# EAGLE design EasterEgg (EAGLE 8.6.0)
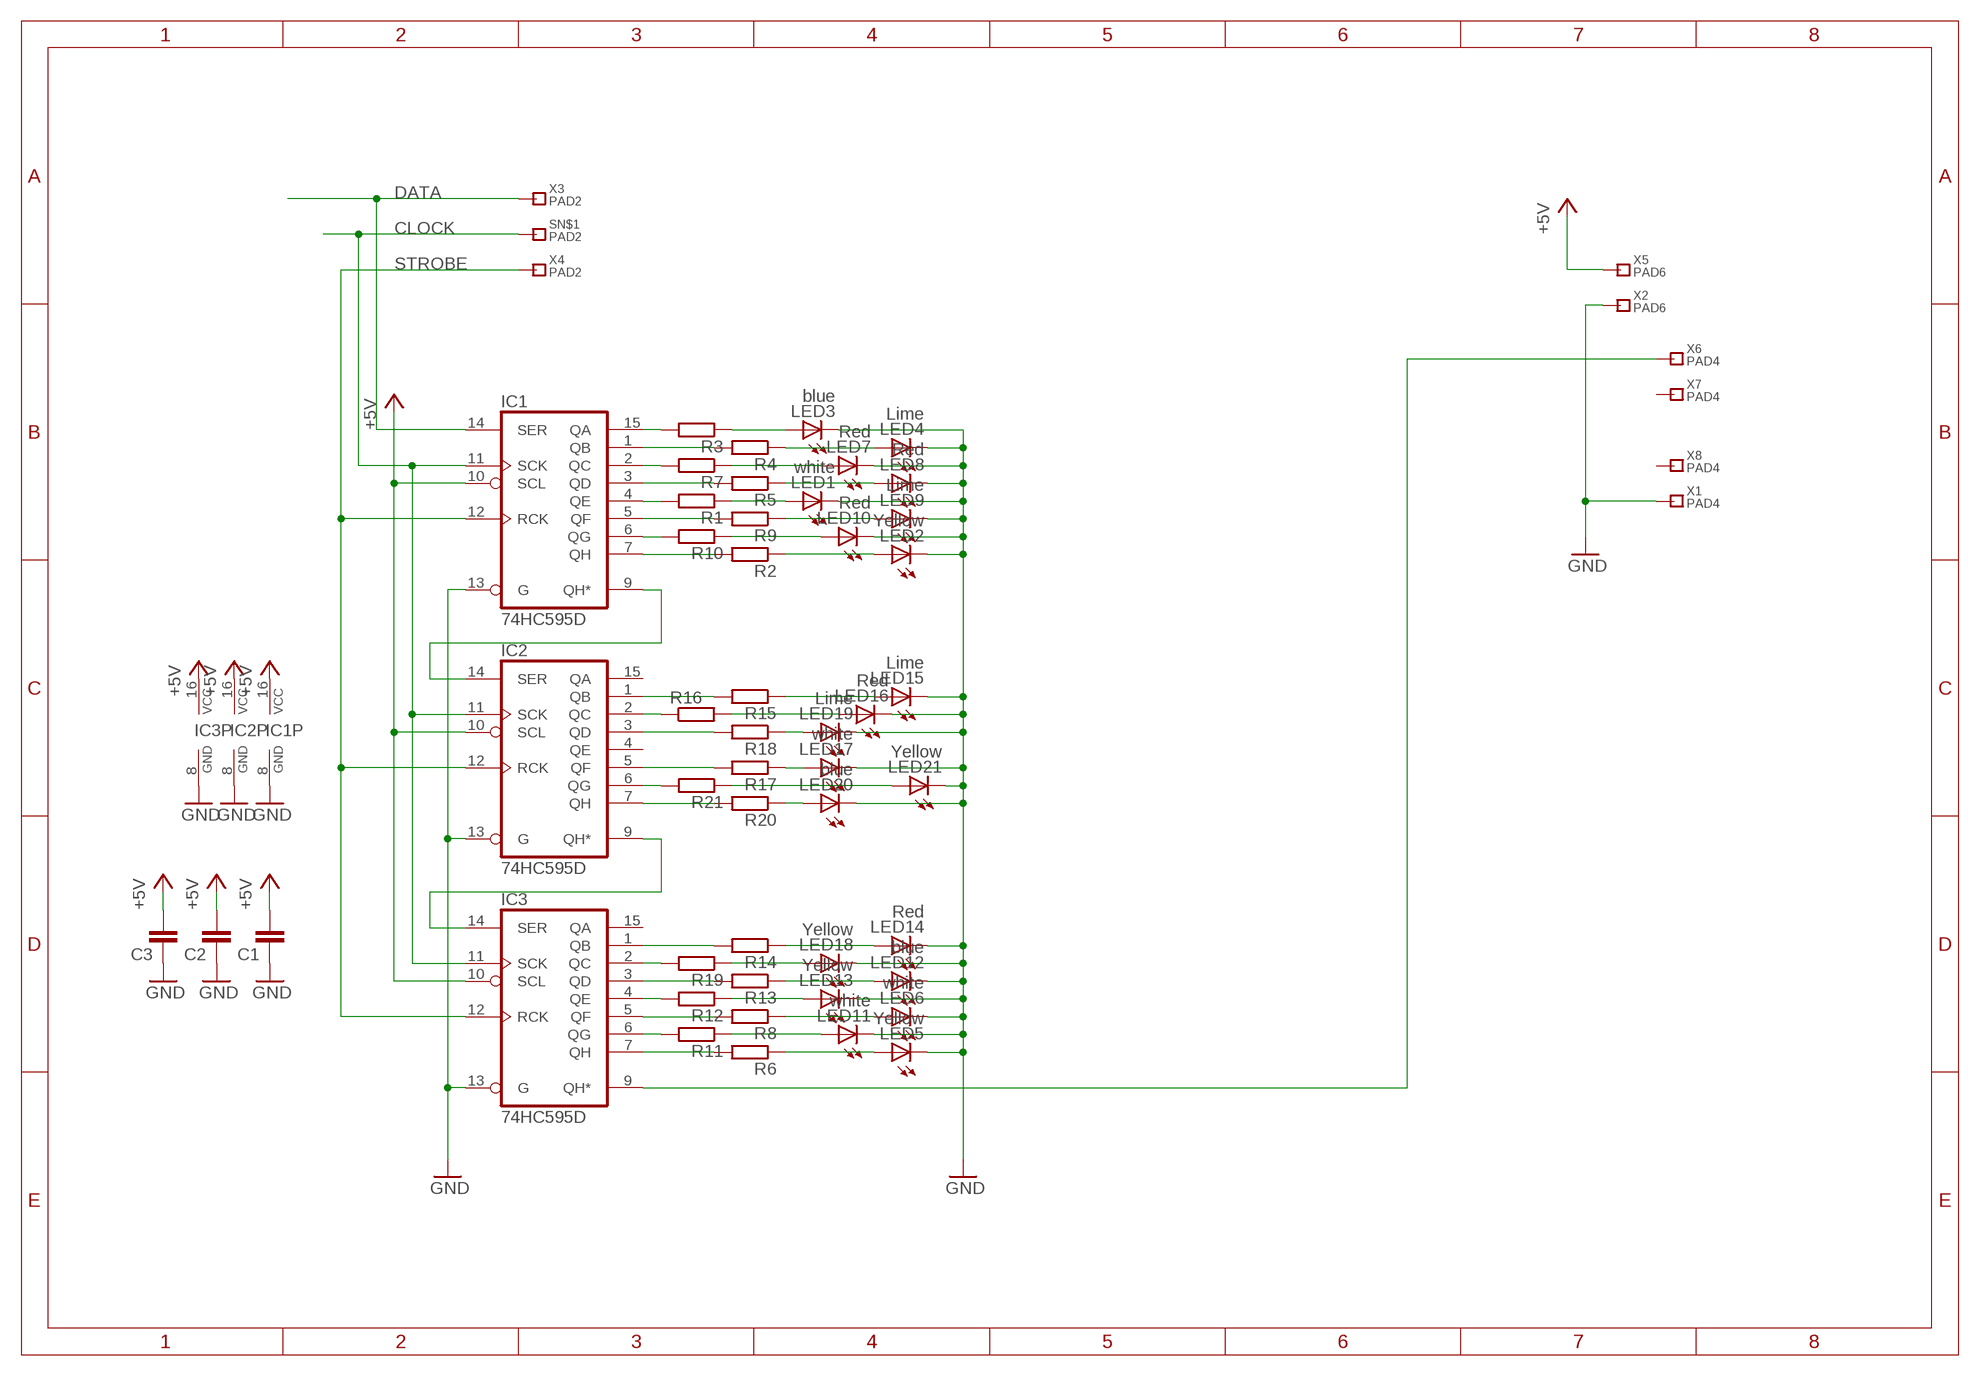
[diagram p0: schematic, sheet 1]

## Parts
C1  C-EUC0805  [C0805]
C2  C-EUC0805  [C0805]
C3  C-EUC0805  [C0805]
IC1  74HC595D  [SO16]
IC2  74HC595D  [SO16]
IC3  74HC595D  [SO16]
LED1  white  LED3MM  [LED3MM]
LED2  Yellow  LED3MM  [LED3MM]
LED3  blue  LED3MM  [LED3MM]
LED4  Lime  LED3MM  [LED3MM]
LED5  Yellow  LED3MM  [LED3MM]
LED6  white  LED3MM  [LED3MM]
LED7  Red  LED3MM  [LED3MM]
LED8  Red  LED3MM  [LED3MM]
LED9  Lime  LED3MM  [LED3MM]
LED10  Red  LED3MM  [LED3MM]
LED11  white  LED3MM  [LED3MM]
LED12  blue  LED3MM  [LED3MM]
LED13  Yellow  LED3MM  [LED3MM]
LED14  Red  LED3MM  [LED3MM]
LED15  Lime  LED3MM  [LED3MM]
LED16  Red  LED3MM  [LED3MM]
LED17  white  LED3MM  [LED3MM]
LED18  Yellow  LED3MM  [LED3MM]
LED19  Lime  LED3MM  [LED3MM]
LED20  blue  LED3MM  [LED3MM]
LED21  Yellow  LED3MM  [LED3MM]
R1  R-EU_R1206  [R1206]
R2  R-EU_R1206  [R1206]
R3  R-EU_R1206  [R1206]
R4  R-EU_R1206  [R1206]
R5  R-EU_R1206  [R1206]
R6  R-EU_R1206  [R1206]
R7  R-EU_R1206  [R1206]
R8  R-EU_R1206  [R1206]
R9  R-EU_R1206  [R1206]
R10  R-EU_R1206  [R1206]
R11  R-EU_R1206  [R1206]
R12  R-EU_R1206  [R1206]
R13  R-EU_R1206  [R1206]
R14  R-EU_R1206  [R1206]
R15  R-EU_R1206  [R1206]
R16  R-EU_R1206  [R1206]
R17  R-EU_R1206  [R1206]
R18  R-EU_R1206  [R1206]
R19  R-EU_R1206  [R1206]
R20  R-EU_R1206  [R1206]
R21  R-EU_R1206  [R1206]
SN$1  PAD2  [SMDPAD_S]
X1  PAD4  [SMDPAD_M]
X2  PAD6  [SMDPAD]
X3  PAD2  [SMDPAD_S]
X4  PAD2  [SMDPAD_S]
X5  PAD6  [SMDPAD]
X6  PAD4  [SMDPAD_M]
X7  PAD4  [SMDPAD_M]
X8  PAD4  [SMDPAD_M]

## Nets
+5V: C1.2 C2.2 C3.2 IC1.10(SCL) IC1.16(VCC) IC2.10(SCL) IC2.16(VCC) IC3.10(SCL) IC3.16(VCC) X5.P$1
CLOCK: IC1.11(SCK) IC2.11(SCK) IC3.11(SCK) SN$1.P$1
DATA: IC1.14(SER) X3.P$1
GND: C1.1 C2.1 C3.1 IC1.8(GND) IC1.13(G) IC2.8(GND) IC2.13(G) IC3.8(GND) IC3.13(G) LED1.K(C) LED2.K(C) LED3.K(C) LED4.K(C) LED5.K(C) LED6.K(C) LED7.K(C) LED8.K(C) LED9.K(C) LED10.K(C) LED11.K(C) LED12.K(C) LED13.K(C) LED14.K(C) LED15.K(C) LED16.K(C) LED17.K(C) LED18.K(C) LED19.K(C) LED20.K(C) LED21.K(C) X1.P$1 X2.P$1
N$2: IC1.2(QC) R7.2
N$3: IC1.9(QH*) IC2.14(SER)
N$4: IC2.9(QH*) IC3.14(SER)
N$5: LED7.A R7.1
N$6: IC1.1(QB) R4.2
N$7: LED4.A R4.1
N$8: IC1.15(QA) R3.2
N$9: LED3.A R3.1
N$10: IC1.7(QH) R2.2
N$11: LED2.A R2.1
N$12: IC1.3(QD) R5.2
N$13: IC1.4(QE) R1.2
N$14: IC1.5(QF) R9.2
N$15: IC1.6(QG) R10.2
N$16: IC2.1(QB) R15.2
N$17: IC2.2(QC) R16.1
N$18: IC2.3(QD) R18.2
N$19: IC2.7(QH) R20.2
N$20: IC2.5(QF) R17.2
N$21: IC2.6(QG) R21.2
N$22: IC3.2(QC) R19.2
N$23: IC3.1(QB) R14.2
N$24: IC3.5(QF) R8.2
N$25: IC3.4(QE) R12.2
N$26: IC3.3(QD) R13.2
N$27: IC3.6(QG) R11.2
N$28: IC3.7(QH) R6.2
N$29: LED10.A R10.1
N$30: LED16.A R16.2
N$31: LED19.A R18.1
N$32: LED20.A R20.1
N$33: LED21.A R21.1
N$34: LED18.A R19.1
N$35: LED14.A R14.1
N$36: LED12.A R13.1
N$37: LED13.A R12.1
N$38: LED5.A R6.1
N$39: LED11.A R11.1
N$40: LED6.A R8.1
N$41: LED17.A R17.1
N$42: LED8.A R5.1
N$43: LED1.A R1.1
N$44: LED9.A R9.1
N$45: LED15.A R15.1
N$46: IC3.9(QH*) X6.P$1
STROBE: IC1.12(RCK) IC2.12(RCK) IC3.12(RCK) X4.P$1
Unconnected: IC2.4(QE) IC2.15(QA) IC3.15(QA) X7.P$1 X8.P$1

## Library data of the parts
C1-C3 = rcl:C-EU: CAPACITOR, European symbol; SPICEPREFIX: C
IC1-IC3 = 74xx-eu:74*595: 8-bit SHIFT REGISTER, output latch
LED1-LED21 = led:LED: LED OSRAM: - CHIPLED LG R971, LG N971, LY N971, LG Q971, LY Q971, LO R971, LY R971 LH N974, LH R974 LS Q976, LO Q976, LY Q976 LO Q996 - Hyper CHIPLED LW Q18S LB Q993, LB Q99A, LB R99A - SideLED LS A670, LO A670, LY A670, LG A670, LP A670 LB A673, LV A673, LT A673, LW A673 LH A674 LY A675 LS A676, LA A676, LO A676, LY A676, LW A676 LS A679, LY A679, LG A679 - Hyper Micro SIDELED® LS Y876, LA Y876, LO Y876, LY Y876 LT Y87S - SmartLED LW L88C, LW L88S LB L89C, LB L89S, LG L890 LS L89K, LO L89K, LY L89K LS L896, LA L896, LO L896, LY L896 - TOPLED LS T670, LO T670, LY T670, LG T670, LP T670 LSG T670, LSP T670, LSY T670, LOP T670, LYG T670 LG T671, LOG T671, LSG T671 LB T673, LV T673, LT T673, LW T673 LH T674 LS T676, LA T676, LO T676, LY T676, LB T676, LH T676, LSB T676, LW T676 LB T67C, LV T67C, LT T67C, LS T67K, LO T67K, LY T67K, LW E67C LS E67B, LA E67B, LO E67B, LY E67B, LB E67C, LV E67C, LT E67C LW T67C LS T679, LY T679, LG T679 LS T770, LO T770, LY T770, LG T770, LP T770 LB T773, LV T773, LT T773, LW T773 LH T774 LS E675, LA E675, LY E675, LS T675 LS T776, LA T776, LO T776, LY T776, LB T776 LHGB T686 LT T68C, LB T68C - Hyper Mini TOPLED® LB M676 - Mini TOPLED Santana® LG M470 LS M47K, LO M47K, LY M47K Source: http://www.osram.convergy.de LUXEON: - LUMILED® LXK2-PW12-R00, LXK2-PW12-S00, LXK2-PW14-U00, LXK2-PW14-V00 LXK2-PM12-R00, LXK2-PM12-S00, LXK2-PM14-U00 LXK2-PE12-Q00, LXK2-PE12-R00, LXK2-PE12-S00, LXK2-PE14-T00, LXK2-PE14-U00 LXK2-PB12-K00, LXK2-PB12-L00, LXK2-PB12-M00, LXK2-PB14-N00, LXK2-PB14-P00, LXK2-PB14-Q00 LXK2-PR12-L00, LXK2-PR12-M00, LXK2-PR14-Q00, LXK2-PR14-R00 LXK2-PD12-Q00, LXK2-PD12-R00, LXK2-PD12-S00 LXK2-PH12-R00, LXK2-PH12-S00 LXK2-PL12-P00, LXK2-PL12-Q00, LXK2-PL12-R00 Source: www.luxeon.com KINGBRIGHT: KA-3528ASYC Source: www.kingbright.com
R1-R21 = rcl:R-EU_: RESISTOR, European symbol; SPICEPREFIX: R
SN$1 X1-X8 = Osterparts:PAD

## Board
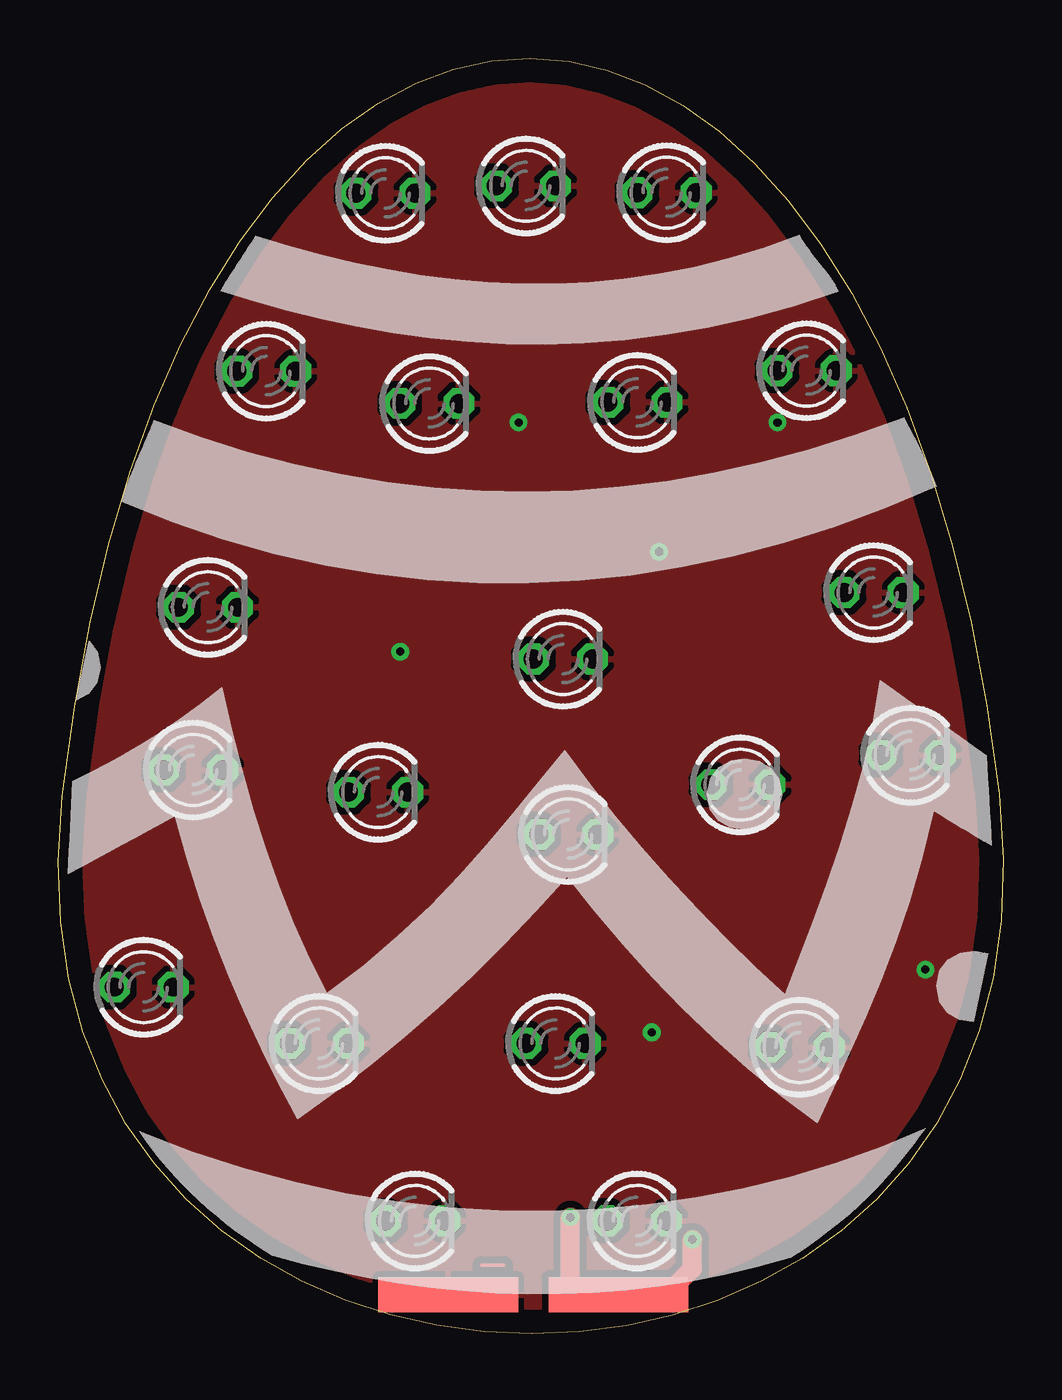
[diagram p1: board, top side]
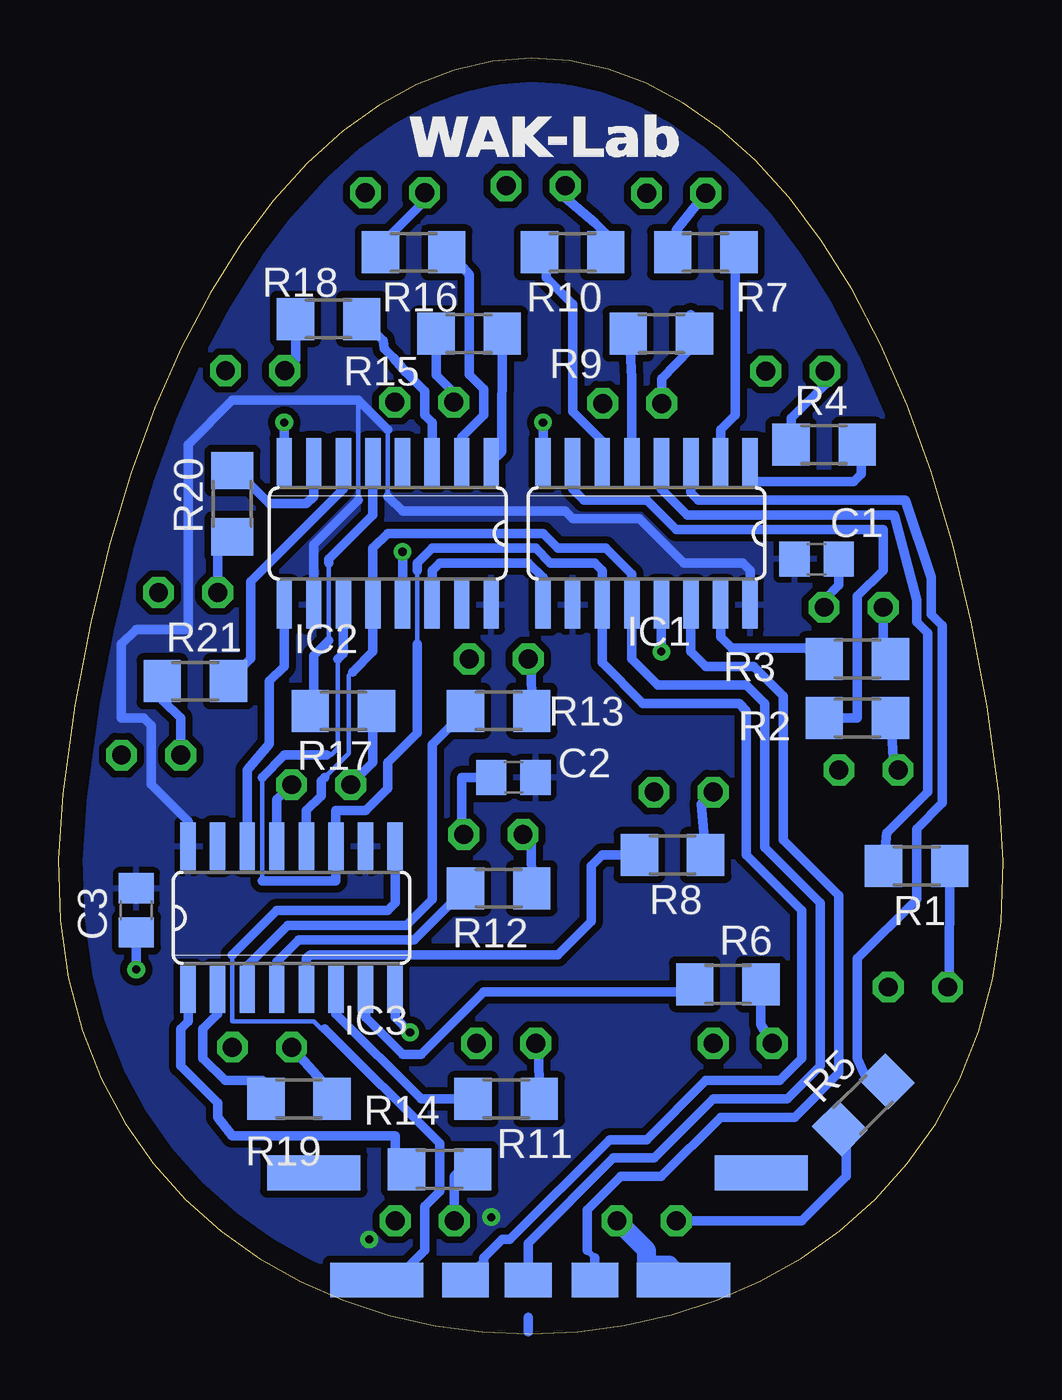
[diagram p2: board, bottom side, seen from below]

Size 40.58 x 54.79 mm. Coordinates in mm from the lower left corner, seen from the top.
Outline: 0.18,23.09 0.71,26.96 1.37,30.57 2.17,33.93 3.09,37.03 4.12,39.89 5.26,42.49 6.49,44.84 7.81,46.94 9.2,48.8 10.66,50.4 12.18,51.75 13.74,52.85 15.34,53.71 16.97,54.32 18.61,54.68 20.27,54.79 21.93,54.65 23.57,54.27 25.2,53.64 26.8,52.76 28.37,51.64 29.88,50.28 31.34,48.66 32.74,46.81 34.05,44.71 35.29,42.36 36.43,39.77 37.46,36.94 38.39,33.87 39.19,30.55 39.86,26.99 40.39,23.19 40.58,20.38 40.49,17.75 40.14,15.3 39.55,13.04 38.73,10.95 37.71,9.05 36.5,7.33 35.13,5.79 33.61,4.43 31.95,3.25 30.18,2.26 28.33,1.45 26.39,0.81 24.4,0.36 22.37,0.09 20.33,0 18.28,0.09 16.25,0.36 14.26,0.82 12.32,1.45 10.46,2.26 8.69,3.25 7.03,4.43 5.5,5.78 4.12,7.32 2.91,9.03 1.88,10.93 1.06,13 0.46,15.25 0.1,17.69 0,20.3 0.18,23.09
Copper layers (1*16): Top 0.035mm / dielectric 1.5mm / Bottom 0.035mm
Design rules "default": minimum track width 6mil, minimum drill 0.35mm, track to track 6mil, track to pad 6mil, pad to pad 6mil, via to via 6mil, smd to smd 6mil, copper to edge 40mil, drill to drill 6mil, minimum pad ring 10mil, minimum via ring 8mil, stop-mask expansion 4mil, vias tented up to drill 0mil, thermal gap 10mil

### Footprints (pad centres in the part's own frame; a part is rotated, then mirrored left to right if it is on the bottom)
C0805 = smd 1.3 x 1.5: 1 -0.95,0; 2 0.95,0
SO16 = smd 0.66 x 2.032: 1 -4.445,-3.073; 2 -3.175,-3.073; 3 -1.905,-3.073; 4 -0.635,-3.073; 5 0.635,-3.073; 6 1.905,-3.073; 7 3.175,-3.073; 8 4.445,-3.073; 9 4.445,3.073; 10 3.175,3.073; 11 1.905,3.073; 12 0.635,3.073; 13 -0.635,3.073; 14 -1.905,3.073; 15 -3.175,3.073; 16 -4.445,3.073
LED3MM = drill 0.813 octagon: A -1.27,0; K 1.27,0
R1206 = smd 1.6 x 1.803: 1 -1.422,0; 2 1.422,0
SMDPAD_S = smd 2 x 1.5: P$1 0,0
SMDPAD_M = smd 4 x 1.5: P$1 0,0
SMDPAD = smd 6 x 1.5: P$1 0,0

### Placement (x,y rotation side)
C1  8.02,33.27 180 bottom
C2  21.03,23.9 0 bottom
C3  37.23,18.19 90 bottom
IC1  15.32,34.38 180 bottom
IC2  26.43,34.38 180 bottom
IC3  30.56,17.87 0 bottom
LED1  3.67,14.89 0 top
LED2  5.79,24.22 0 top
LED3  6.43,31.21 0 top
LED4  8.93,41.35 0 top
LED5  11.19,12.47 0 top
LED6  13.73,23.27 0 top
LED7  14.05,48.99 0 top
LED8  15.32,4.85 0 top
LED9  15.93,39.96 0 top
LED10  20.08,49.3 0 top
LED11  21.35,12.47 0 top
LED12  21.67,28.98 0 top
LED13  21.89,21.45 0 top
LED14  24.84,4.85 0 top
LED15  24.87,40.01 0 top
LED16  26.12,49.01 0 top
LED17  29.29,23.59 0 top
LED18  31.83,12.32 0 top
LED19  32.13,41.37 0 top
LED20  35,31.84 0 top
LED21  36.59,24.86 0 top
R1  3.73,20.09 180 bottom
R2  6.27,26.44 180 bottom
R3  6.27,28.98 180 bottom
R4  7.7,38.19 0 bottom
R5  6.02,9.84 45 bottom
R6  11.83,15.01 180 bottom
R7  12.78,46.45 0 bottom
R8  14.21,20.57 180 bottom
R9  14.68,42.95 180 bottom
R10  18.49,46.45 180 bottom
R11  21.35,10.09 180 bottom
R12  21.67,19.14 180 bottom
R13  21.67,26.76 180 bottom
R14  24.21,7.08 180 bottom
R15  22.94,42.95 0 bottom
R16  25.32,46.45 180 bottom
R17  28.34,26.76 180 bottom
R18  28.97,43.59 0 bottom
R19  30.24,10.09 180 bottom
R20  33.1,35.65 90 bottom
R21  34.69,28.03 0 bottom
SN$1  23.1,2.31 0 bottom
X1  13.73,2.31 0 bottom
X2  16.75,1.68 0 top
X3  17.54,2.31 0 bottom
X4  20.4,2.31 0 bottom
X5  24.05,1.68 0 top
X6  26.91,2.31 0 bottom
X7  10.4,6.92 180 bottom
X8  29.61,6.92 180 bottom

### Tracks (layer width: path | path; a pad name or v marks a point on that pad's centre or on a via)
+5V  (via drill 0.35)
  Top 0.813: X5.P$1 25.48,1.68 | X5.P$1 22.3,1.68 21.99,2 v21.99,5.01 | X5.P$1 24.21,2 26.43,2 27.23,2.79 v27.23,4.06
  Bottom 0.203: 26.43,38.83 26.43,35.97 | 27.7,35.81 27.7,40.1
  Bottom 0.406: IC3.16 35,22 36.59,23.59 36.59,26.13 36.91,26.44 37.86,26.44 37.86,29.62 37.23,30.26 35,30.26 35,38.19 33.1,40.1 27.7,40.1 26.43,38.83 | 26.43,35.97 25.8,35.33 18.81,35.33 18.49,35.02 15.64,35.02 13.73,33.11 11.19,33.11 10.87,32.8 IC1.16 | IC2.10 29.61,33.91 27.7,35.81
  pour Bottom (isolate 0.305): 0.71,26.96 1.37,30.57 2.17,33.93 3.09,37.03 4.12,39.89 5.26,42.49 6.49,44.84 7.81,46.94 9.2,48.8 10.66,50.4 12.18,51.75 13.74,52.85 15.34,53.71 16.97,54.32 18.61,54.68 20.27,54.79 21.93,54.65 23.57,54.27 25.2,53.64 26.8,52.76 28.37,51.64 29.88,50.28 31.34,48.66 32.74,46.81 34.05,44.71 35.29,42.36 36.43,39.77 37.46,36.94 38.39,33.87 39.19,30.55 39.86,26.99 40.39,23.19 40.58,20.38 40.49,17.75 40.14,15.3 39.55,13.04 38.73,10.95 37.71,9.05 36.5,7.33 35.13,5.79 33.61,4.43 31.95,3.25 30.18,2.26 28.33,1.45 26.39,0.81 24.4,0.36 22.37,0.09 20.33,0 18.28,0.09 16.25,0.36 14.26,0.82 12.32,1.45 10.46,2.26 8.69,3.25 7.03,4.43 5.5,5.78 4.12,7.32 2.91,9.03 1.88,10.93 1.06,13 0.46,15.25 0.1,17.69 0,20.3 0.18,23.09
CLOCK
  Bottom 0.203: 25.16,32.8 25.16,29.62 | 31.83,19.46 31.83,23.9 | 29.05,24.86 28.85,24.86 28.57,25.13 28.57,28.98
  Bottom 0.406: SN$1.P$1 22.3,3.11 22.3,3.27 21.51,4.06 21.19,4.06 16.91,8.35 15.32,8.35 12.78,10.89 9.6,10.89 8.65,11.84 8.65,18.19 11.03,20.57 11.03,26.76 11.35,27.08 15.48,27.08 17.22,28.83 IC1.11 17.22,32.8 17.54,33.11 19.45,33.11 20.08,33.75 24.53,33.75 25.16,33.11 25.16,32.8 | 31.83,19.46 28.65,19.46 IC3.11 28.65,22.48 27.38,22.48 26.43,23.43 26.43,24.54 25.16,25.81 25.16,29.62 | 31.83,23.9 30.88,24.86 29.05,24.86 | 28.57,28.98 28.34,29.22 IC2.11
DATA
  Bottom 0.254: 17.54,3.27 17.86,3.59
  Bottom 0.406: X3.P$1 17.54,3.27 | 17.86,3.59 17.86,5.33 16.43,6.76 14.68,6.76 12.14,9.3 8.97,9.3 7.06,11.21 7.06,18.83 9.45,21.21 9.45,27.4 10.72,28.67 12.78,28.67 13.41,29.3 IC1.14
GND  (via drill 0.35)
  Bottom 0.406: IC1.8 v19.76,39.15 | IC2.8 v30.88,39.15 | IC3.8 26.11,13.59 v25.48,12.95 | IC2.13 v25.8,33.59 | IC1.13 v14.68,29.3 | LED17.K 31.19,22.95 IC3.13 | C3.1 v37.23,15.65 | C2.1 23.26,23.9 23.26,21.54 LED13.K | LED3.K 7.7,31.53 7.06,32.16 C1.1
  Bottom 0.813: X1.P$1 14.37,2.95 15.32,2.95 15.32,3.59 LED8.K
  pour Top (isolate 0.305): 0.71,26.96 1.37,30.57 2.17,33.93 3.09,37.03 4.12,39.89 5.26,42.49 6.49,44.84 7.81,46.94 9.2,48.8 10.66,50.4 12.18,51.75 13.74,52.85 15.34,53.71 16.97,54.32 18.61,54.68 20.27,54.79 21.93,54.65 23.57,54.27 25.2,53.64 26.8,52.76 28.37,51.64 29.88,50.28 31.34,48.66 32.74,46.81 34.05,44.71 35.29,42.36 36.43,39.77 37.46,36.94 38.39,33.87 39.19,30.55 39.86,26.99 40.39,23.19 40.58,20.38 40.49,17.75 40.14,15.3 39.55,13.04 38.73,10.95 37.71,9.05 36.5,7.33 35.13,5.79 33.61,4.43 31.95,3.25 30.18,2.26 28.33,1.45 26.39,0.81 24.4,0.36 22.37,0.09 20.33,0 18.28,0.09 16.25,0.36 14.26,0.82 12.32,1.45 10.46,2.26 8.69,3.25 7.03,4.43 5.5,5.78 4.12,7.32 2.91,9.03 1.88,10.93 1.06,13 0.46,15.25 0.1,17.69 0,20.3 0.18,23.09
N$1
  Top 0.152: 18.18,2.95 19.13,2.95
N$2
  Bottom 0.254: 11.51,46.32 R7.2
  Bottom 0.406: IC1.2 12.14,38.83 11.51,39.46 11.51,46.32
N$3
  Bottom 0.406: IC2.14 24.53,32.8 24.21,33.11 20.4,33.11 19.76,32.48 IC1.9
N$4
  Bottom 0.254: IC2.9 30.88,30.26
  Bottom 0.406: IC3.14 32.46,24.22 31.51,25.33 31.51,28.03 30.88,28.67 30.88,30.26
N$5
  Bottom 0.406: LED7.A 14.05,47.4 14.18,46.58 R7.1
N$6
  Bottom 0.254: 6.11,38.32 R4.2
  Bottom 0.406: IC1.1 10.87,36.61 6.43,36.61 6.11,36.92 6.11,38.32
N$7
  Bottom 0.406: R4.1 9.1,39.33 7.66,40.77 LED4.A
N$8
  Bottom 0.406: IC1.15 12.14,29.94 11.67,29.46 8.49,29.46 7.7,28.67 7.51,28.85 R3.2
N$9
  Bottom 0.406: LED3.A 5.16,29.43 R3.1
N$10
  Bottom 0.406: R2.2 6.27,26.44 6.27,31.68 5.16,32.8 5.16,34.54 14.05,34.54 15.32,35.81 18.02,35.81 18.49,36.29 IC1.7
N$11
  Bottom 0.406: R2.1 4.71,24.41 LED2.A
N$12
  Bottom 0.406: IC1.3 13.41,36.13 13.1,35.81 4.21,35.81 3.1,32.48 3.1,30.89 2.62,30.41 2.62,22.79 3.73,21.68 3.73,18.67 6.27,16.13 6.27,11.84 5.98,11.18 R5.2
N$13
  Bottom 0.406: R1.2 5,21.52 3.25,23.27 3.25,30.1 3.73,30.57 3.73,31.53 4.68,35.18 13.57,35.18 14.68,36.29 IC1.4
N$14
  Bottom 0.406: IC1.5 15.95,41.05 16.08,43.4 R9.2
N$15
  Bottom 0.406: R10.2 19.63,46.58 19.63,45.37 18.49,44.23 18.49,39.62 17.22,38.35 IC1.6
N$16
  Bottom 0.406: IC2.1 21.54,37.9 R15.2
N$17
  Bottom 0.406: IC2.2 23.26,38.51 22.3,39.46 22.3,40.57 22.94,41.21 22.94,45.5 23.89,46.61 R16.1
N$18
  Bottom 0.406: IC2.3 24.53,39.15 24.84,39.46 24.84,40.49 25.64,41.28 26.19,41.92 26.59,42.32 26.62,42.67 R18.2
N$19
  Bottom 0.406: R20.2 32.78,36.92 31.51,35.65 29.92,35.65 29.61,35.97 IC2.7
N$20
  Bottom 0.203: 28.97,33.11 28.97,29.78
  Bottom 0.406: IC2.5 27.07,35.18 28.97,33.27 28.97,33.11 | 28.97,29.78 29.61,29.14 29.61,26.76 R17.2
N$21
  Bottom 0.406: R21.2 32.31,29.01 32.31,32.32 28.34,36.29 IC2.6
N$22
  Bottom 0.406: IC3.2 33.73,13.74 34.37,13.11 34.37,11.84 33.42,10.89 31.83,10.89 R19.2
N$23
  Bottom 0.406: IC3.1 35,13.43 35.32,13.11 35.32,11.52 33.73,9.93 33.73,9.3 33.1,8.51 26.11,8.51 26.11,7.08 R14.2
N$24
  Bottom 0.406: IC3.5 29.92,16.13 29.77,16.28 19.13,16.28 17.7,17.71 17.7,20.1 17.22,20.57 R8.2
N$25
  Bottom 0.406: IC3.4 31.19,15.97 30.24,16.92 25.29,16.92 R12.2
N$26
  Bottom 0.406: IC3.3 32.46,15.81 30.72,17.55 25.64,17.55 24.53,18.67 24.53,25.3 R13.2
N$27
  Bottom 0.406: IC3.6 28.65,13.74 25,10.09 R11.2
N$28
  Bottom 0.406: IC3.7 27.38,13.59 25.8,12 25,12 22.3,14.7 13.23,14.7 R6.2
N$29
  Bottom 0.406: LED10.A 18.81,48.8 17.54,47.72 17.09,47.27 R10.1
N$30
  Bottom 0.406: LED16.A 24.87,48.99 24.53,48.99 26.88,46.63 R16.2
N$31
  Bottom 0.406: R18.1 30.37,41.83 LED19.A
N$32
  Bottom 0.406: R20.1 33.73,34.06 LED20.A
N$33
  Bottom 0.406: R21.1 36.09,27.21 35.32,26.44 LED21.A
N$34
  Bottom 0.406: LED18.A 29.29,10.89 29.29,9.81 | 29.29,9.62 29.29,9.81 | 29.29,9.81 R19.1
N$35
  Bottom 0.406: LED14.A 23.57,6.76 23.26,7.08 R14.1
N$36
  Bottom 0.406: R13.1 20.27,28.85 LED12.A
N$37
  Bottom 0.406: R12.1 20.27,21.1 LED13.A
N$38
  Bottom 0.406: R6.1 10.43,13.3 LED5.A
N$39
  Bottom 0.406: LED11.A 19.95,12.34 R11.1
N$40
  Bottom 0.406: R8.1 12.97,22.76 LED6.A
N$41
  Bottom 0.406: LED17.A 27.07,24.54 27.07,26.32 R17.1
N$42
  Bottom 0.406: R5.1 6.75,8.03 6.75,6.76 8.65,4.86 LED8.A
N$43
  Bottom 0.406: R1.1 2.33,14.96 LED1.A
N$44
  Bottom 0.406: LED9.A 14.66,41.03 13.41,42.32 13.41,43.78 R9.1
N$45
  Bottom 0.406: LED15.A 23.6,40.44 24.34,41.18 R15.1
N$46
  Bottom 0.203: 33.1,16.28 33.1,13.43 29.61,13.43 29.29,13.11 29.13,13.11
  Bottom 0.406: IC3.9 26.11,18.51 26.43,18.19 31.19,18.19 33.1,16.28 | X6.P$1 26.11,2.32 24.84,3.59 24.84,5.49 24.21,6.12 24.21,8.19 29.13,13.11
N$47
  Bottom 0.406: 20.4,0.73 20.4,0.09
STROBE
  Bottom 0.203: 27.94,28.43 28.1,28.27 28.1,24.94 29.13,23.9
  Bottom 0.406: 27.94,28.43 27.07,29.3 IC2.12 27.07,33.75 26.43,34.38 19.76,34.38 19.13,33.75 17.07,33.75 15.95,32.64 IC1.12 15.95,28.98 14.84,27.87 11.03,27.87 10.24,27.08 10.24,20.89 7.86,18.51 7.86,11.52 9.29,10.09 12.46,10.09 15,7.55 16.75,7.55 20.4,3.9 X4.P$1 | 29.13,23.9 29.29,23.75 29.29,23.11 29.92,22.48 IC3.12